# Altium schematic sheet Project.SchDoc
size A4
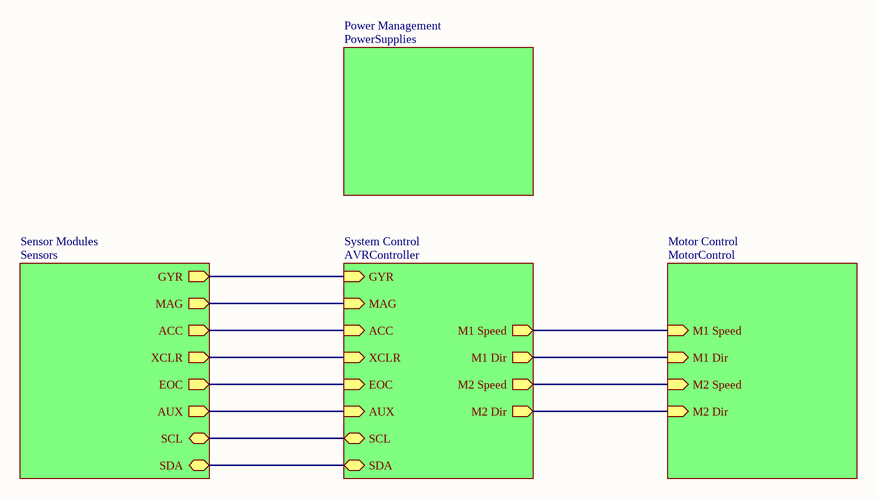
[diagram p0: Project.SchDoc]

## Sub-sheets
Motor Control = MotorControl: M1 Speed (in), M1 Dir (in), M2 Speed (in), M2 Dir (in)
Power Management = PowerSupplies: no entries
Sensor Modules = Sensors: GYR (out), MAG (out), ACC (out), XCLR (out), EOC (out), AUX (out), SCL (bidir), SDA (bidir)
System Control = AVRController: GYR (in), MAG (in), ACC (in), XCLR (in), EOC (in), AUX (in), SCL (bidir), SDA (bidir), M1 Speed (out), M1 Dir (out), M2 Speed (out), M2 Dir (out)

## Nets
(unnamed): sheet System Control/GYR, sheet Sensor Modules/GYR
(unnamed): sheet System Control/MAG, sheet Sensor Modules/MAG
(unnamed): sheet System Control/ACC, sheet Sensor Modules/ACC
(unnamed): sheet System Control/XCLR, sheet Sensor Modules/XCLR
(unnamed): sheet System Control/EOC, sheet Sensor Modules/EOC
(unnamed): sheet System Control/AUX, sheet Sensor Modules/AUX
(unnamed): sheet System Control/SCL, sheet Sensor Modules/SCL
(unnamed): sheet System Control/SDA, sheet Sensor Modules/SDA
(unnamed): sheet System Control/M1 Speed, sheet Motor Control/M1 Speed
(unnamed): sheet System Control/M1 Dir, sheet Motor Control/M1 Dir
(unnamed): sheet System Control/M2 Speed, sheet Motor Control/M2 Speed
(unnamed): sheet System Control/M2 Dir, sheet Motor Control/M2 Dir